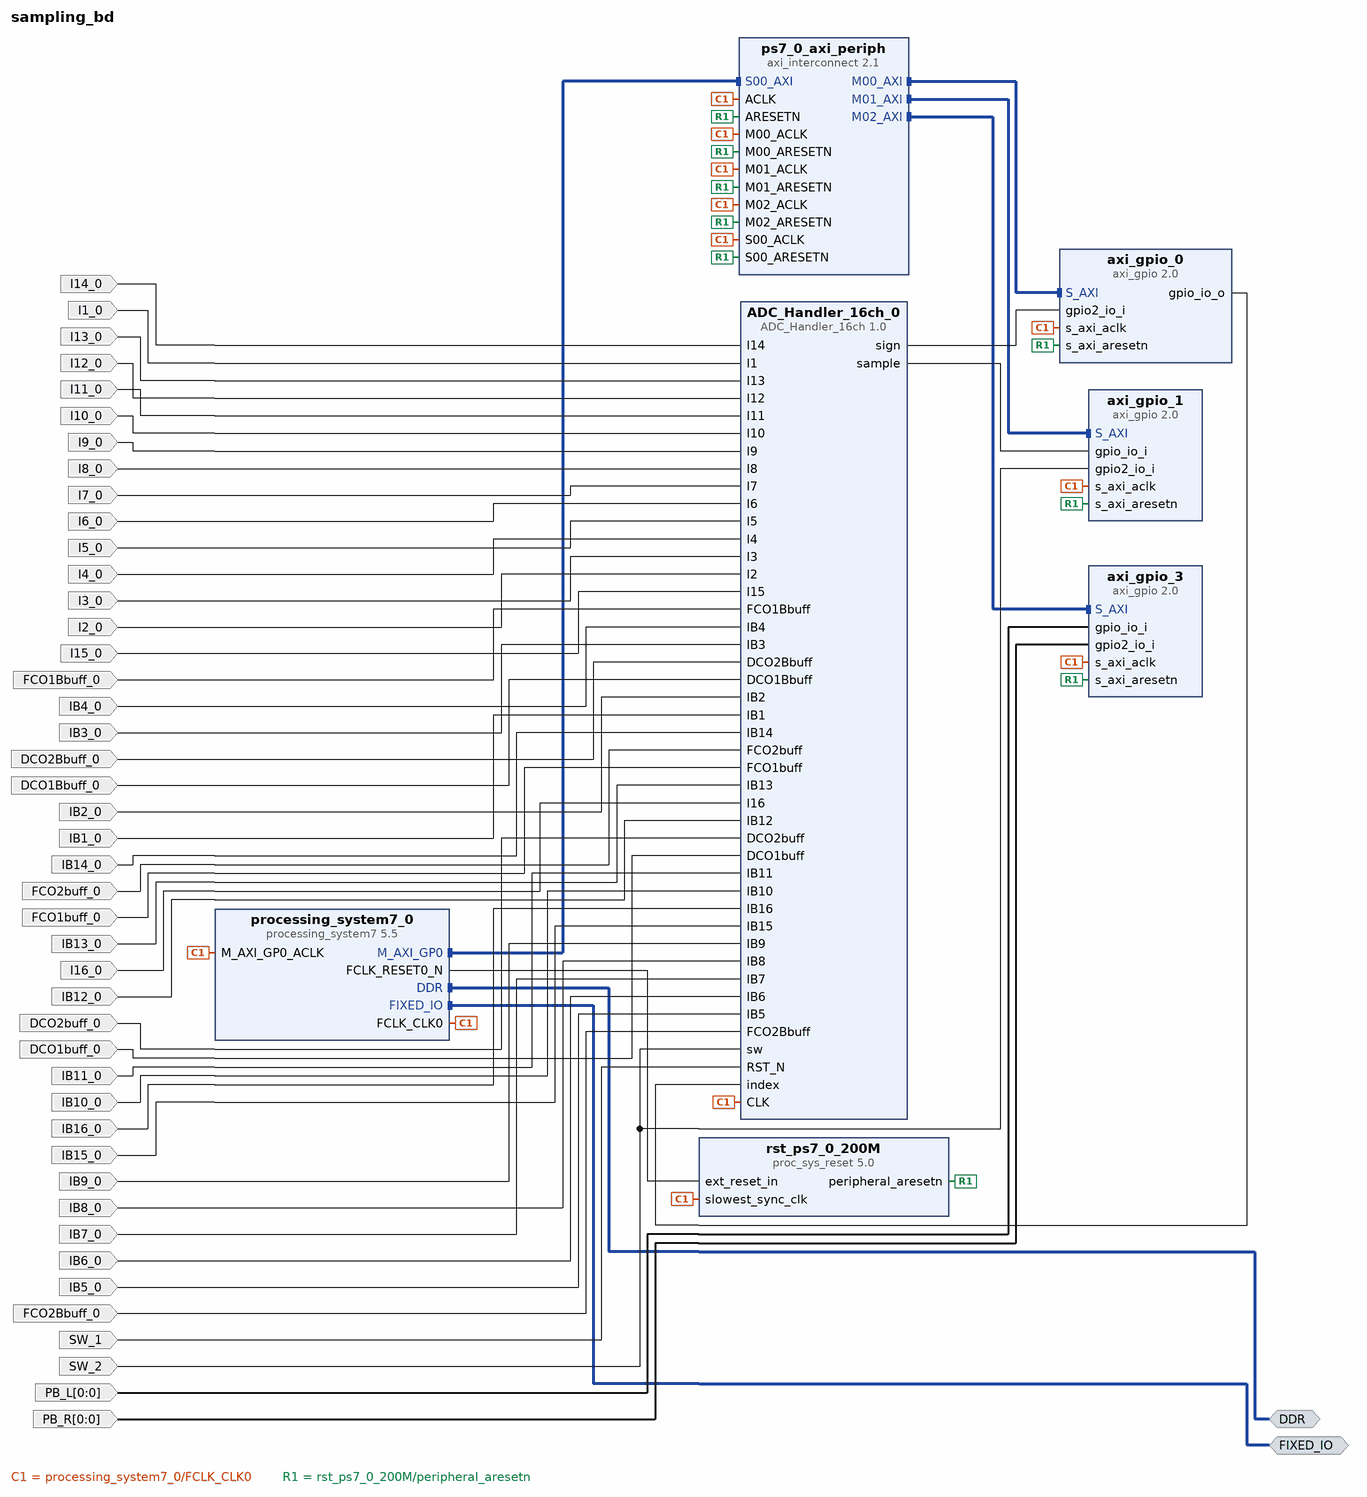
[diagram p0: block diagram of the top level]
# Vivado block design sampling_bd, xc7z020clg484-1, Vivado 2018.3
create_bd_design sampling_bd

create_bd_intf_port -mode Master -vlnv xilinx.com:interface:ddrx_rtl:1.0 DDR
create_bd_intf_port -mode Master -vlnv xilinx.com:display_processing_system7:fixedio_rtl:1.0 FIXED_IO
create_bd_port -dir I I14_0
create_bd_port -dir I I1_0
create_bd_port -dir I I13_0
create_bd_port -dir I I12_0
create_bd_port -dir I I11_0
create_bd_port -dir I I10_0
create_bd_port -dir I I9_0
create_bd_port -dir I I8_0
create_bd_port -dir I I7_0
create_bd_port -dir I I6_0
create_bd_port -dir I I5_0
create_bd_port -dir I I4_0
create_bd_port -dir I I3_0
create_bd_port -dir I I2_0
create_bd_port -dir I I15_0
create_bd_port -dir I FCO1Bbuff_0
create_bd_port -dir I IB4_0
create_bd_port -dir I IB3_0
create_bd_port -dir I DCO2Bbuff_0
create_bd_port -dir I DCO1Bbuff_0
create_bd_port -dir I IB2_0
create_bd_port -dir I IB1_0
create_bd_port -dir I IB14_0
create_bd_port -dir I FCO2buff_0
create_bd_port -dir I FCO1buff_0
create_bd_port -dir I IB13_0
create_bd_port -dir I I16_0
create_bd_port -dir I IB12_0
create_bd_port -dir I DCO2buff_0
create_bd_port -dir I DCO1buff_0
create_bd_port -dir I IB11_0
create_bd_port -dir I IB10_0
create_bd_port -dir I IB16_0
create_bd_port -dir I IB15_0
create_bd_port -dir I IB9_0
create_bd_port -dir I IB8_0
create_bd_port -dir I IB7_0
create_bd_port -dir I IB6_0
create_bd_port -dir I IB5_0
create_bd_port -dir I FCO2Bbuff_0
create_bd_port -dir I -type rst SW_1
create_bd_port -dir I SW_2
create_bd_port -dir I -from 0 -to 0 PB_R
create_bd_port -dir I -from 0 -to 0 PB_L

create_bd_cell -type ip -vlnv xilinx.com:ip:processing_system7:5.5 processing_system7_0
set_property -dict [list \
  CONFIG.PCW_APU_PERIPHERAL_FREQMHZ 666.666666 \
  CONFIG.PCW_CAN0_CAN0_IO {MIO 46 .. 47} \
  CONFIG.PCW_CAN0_PERIPHERAL_ENABLE 1 \
  CONFIG.PCW_CAN_PERIPHERAL_FREQMHZ 23.8095 \
  CONFIG.PCW_ENET0_ENET0_IO {MIO 16 .. 27} \
  CONFIG.PCW_ENET0_GRP_MDIO_ENABLE 1 \
  CONFIG.PCW_ENET0_GRP_MDIO_IO {MIO 52 .. 53} \
  CONFIG.PCW_ENET0_PERIPHERAL_ENABLE 1 \
  CONFIG.PCW_ENET0_PERIPHERAL_FREQMHZ {100 Mbps} \
  CONFIG.PCW_ENET0_RESET_ENABLE 1 \
  CONFIG.PCW_ENET0_RESET_IO {MIO 11} \
  CONFIG.PCW_ENET_RESET_ENABLE 1 \
  CONFIG.PCW_ENET_RESET_SELECT {Share reset pin} \
  CONFIG.PCW_FPGA0_PERIPHERAL_FREQMHZ 200 \
  CONFIG.PCW_GPIO_MIO_GPIO_ENABLE 1 \
  CONFIG.PCW_GPIO_MIO_GPIO_IO MIO \
  CONFIG.PCW_I2C0_GRP_INT_ENABLE 0 \
  CONFIG.PCW_I2C0_I2C0_IO {MIO 50 .. 51} \
  CONFIG.PCW_I2C0_PERIPHERAL_ENABLE 1 \
  CONFIG.PCW_I2C0_RESET_ENABLE 1 \
  CONFIG.PCW_I2C0_RESET_IO {MIO 13} \
  CONFIG.PCW_I2C_PERIPHERAL_FREQMHZ 111.111115 \
  CONFIG.PCW_I2C_RESET_ENABLE 1 \
  CONFIG.PCW_I2C_RESET_SELECT {Share reset pin} \
  CONFIG.PCW_PRESET_BANK0_VOLTAGE {LVCMOS 1.8V} \
  CONFIG.PCW_PRESET_BANK1_VOLTAGE {LVCMOS 1.8V} \
  CONFIG.PCW_QSPI_GRP_FBCLK_ENABLE 1 \
  CONFIG.PCW_QSPI_GRP_FBCLK_IO {MIO 8} \
  CONFIG.PCW_QSPI_GRP_SINGLE_SS_ENABLE 1 \
  CONFIG.PCW_QSPI_GRP_SINGLE_SS_IO {MIO 1 .. 6} \
  CONFIG.PCW_QSPI_PERIPHERAL_ENABLE 1 \
  CONFIG.PCW_QSPI_QSPI_IO {MIO 1 .. 6} \
  CONFIG.PCW_SD0_GRP_CD_ENABLE 1 \
  CONFIG.PCW_SD0_GRP_CD_IO {MIO 0} \
  CONFIG.PCW_SD0_GRP_WP_ENABLE 1 \
  CONFIG.PCW_SD0_GRP_WP_IO {MIO 15} \
  CONFIG.PCW_SD0_PERIPHERAL_ENABLE 1 \
  CONFIG.PCW_SD0_SD0_IO {MIO 40 .. 45} \
  CONFIG.PCW_SDIO_PERIPHERAL_FREQMHZ 50 \
  CONFIG.PCW_SINGLE_QSPI_DATA_MODE x4 \
  CONFIG.PCW_TTC0_PERIPHERAL_ENABLE 1 \
  CONFIG.PCW_TTC0_TTC0_IO EMIO \
  CONFIG.PCW_UART1_PERIPHERAL_ENABLE 1 \
  CONFIG.PCW_UART1_UART1_IO {MIO 48 .. 49} \
  CONFIG.PCW_UART_PERIPHERAL_FREQMHZ 50 \
  CONFIG.PCW_UIPARAM_DDR_FREQ_MHZ 533.333333 \
  CONFIG.PCW_UIPARAM_DDR_PARTNO {MT41J256M8 HX-15E} \
  CONFIG.PCW_USB0_PERIPHERAL_ENABLE 1 \
  CONFIG.PCW_USB0_RESET_ENABLE 1 \
  CONFIG.PCW_USB0_RESET_IO {MIO 7} \
  CONFIG.PCW_USB0_USB0_IO {MIO 28 .. 39} \
  CONFIG.PCW_USB_RESET_ENABLE 1 \
  CONFIG.PCW_USB_RESET_SELECT {Share reset pin} \
  CONFIG.preset ZC702 \
] [get_bd_cells processing_system7_0]
# 222 more settings of processing_system7_0 are not shown: defaults, MIO pin electricals, DDR timing, and values the tool derives
create_bd_cell -type ip -vlnv xilinx.com:user:ADC_Handler_16ch:1.0 ADC_Handler_16ch_0
create_bd_cell -type ip -vlnv xilinx.com:ip:axi_gpio:2.0 axi_gpio_0
set_property -dict [list \
  CONFIG.C_ALL_INPUTS 0 \
  CONFIG.C_ALL_INPUTS_2 1 \
  CONFIG.C_ALL_OUTPUTS 1 \
  CONFIG.C_GPIO_WIDTH 32 \
  CONFIG.C_IS_DUAL 1 \
  CONFIG.GPIO_BOARD_INTERFACE Custom \
  CONFIG.USE_BOARD_FLOW true \
] [get_bd_cells axi_gpio_0]
create_bd_cell -type ip -vlnv xilinx.com:ip:axi_gpio:2.0 axi_gpio_1
set_property -dict [list \
  CONFIG.C_ALL_INPUTS_2 1 \
  CONFIG.C_GPIO2_WIDTH 1 \
  CONFIG.C_GPIO_WIDTH 32 \
  CONFIG.C_IS_DUAL 1 \
  CONFIG.GPIO_BOARD_INTERFACE Custom \
  CONFIG.USE_BOARD_FLOW true \
] [get_bd_cells axi_gpio_1]
create_bd_cell -type ip -vlnv xilinx.com:ip:axi_gpio:2.0 axi_gpio_3
set_property -dict [list \
  CONFIG.C_ALL_INPUTS_2 1 \
  CONFIG.C_GPIO2_WIDTH 1 \
  CONFIG.C_GPIO_WIDTH 1 \
  CONFIG.C_IS_DUAL 1 \
  CONFIG.GPIO_BOARD_INTERFACE Custom \
  CONFIG.USE_BOARD_FLOW true \
] [get_bd_cells axi_gpio_3]
create_bd_cell -type ip -vlnv xilinx.com:ip:axi_interconnect:2.1 ps7_0_axi_periph
set_property -dict {CONFIG.NUM_MI 3} [get_bd_cells ps7_0_axi_periph]
create_bd_cell -type ip -vlnv xilinx.com:ip:proc_sys_reset:5.0 rst_ps7_0_200M

# ---- connections ----

connect_bd_intf_net [get_bd_intf_pins ps7_0_axi_periph/M02_AXI] [get_bd_intf_pins axi_gpio_3/S_AXI]
connect_bd_intf_net [get_bd_intf_pins ps7_0_axi_periph/M00_AXI] [get_bd_intf_pins axi_gpio_0/S_AXI]
connect_bd_intf_net [get_bd_intf_pins ps7_0_axi_periph/M01_AXI] [get_bd_intf_pins axi_gpio_1/S_AXI]
connect_bd_intf_net [get_bd_intf_pins processing_system7_0/M_AXI_GP0] [get_bd_intf_pins ps7_0_axi_periph/S00_AXI]
connect_bd_intf_net [get_bd_intf_ports DDR] [get_bd_intf_pins processing_system7_0/DDR]
connect_bd_intf_net [get_bd_intf_ports FIXED_IO] [get_bd_intf_pins processing_system7_0/FIXED_IO]
connect_bd_net [get_bd_pins processing_system7_0/FCLK_CLK0] \
  [get_bd_pins ADC_Handler_16ch_0/CLK] [get_bd_pins processing_system7_0/M_AXI_GP0_ACLK] \
  [get_bd_pins ps7_0_axi_periph/S00_ACLK] [get_bd_pins rst_ps7_0_200M/slowest_sync_clk] [get_bd_pins axi_gpio_0/s_axi_aclk] \
  [get_bd_pins ps7_0_axi_periph/M00_ACLK] [get_bd_pins ps7_0_axi_periph/ACLK] [get_bd_pins axi_gpio_1/s_axi_aclk] \
  [get_bd_pins ps7_0_axi_periph/M01_ACLK] [get_bd_pins axi_gpio_3/s_axi_aclk] [get_bd_pins ps7_0_axi_periph/M02_ACLK]
connect_bd_net -net I14_0_1 [get_bd_ports I14_0] [get_bd_pins ADC_Handler_16ch_0/I14]
connect_bd_net -net I1_0_1 [get_bd_ports I1_0] [get_bd_pins ADC_Handler_16ch_0/I1]
connect_bd_net -net I13_0_1 [get_bd_ports I13_0] [get_bd_pins ADC_Handler_16ch_0/I13]
connect_bd_net -net I12_0_1 [get_bd_ports I12_0] [get_bd_pins ADC_Handler_16ch_0/I12]
connect_bd_net -net I11_0_1 [get_bd_ports I11_0] [get_bd_pins ADC_Handler_16ch_0/I11]
connect_bd_net -net I10_0_1 [get_bd_ports I10_0] [get_bd_pins ADC_Handler_16ch_0/I10]
connect_bd_net -net I9_0_1 [get_bd_ports I9_0] [get_bd_pins ADC_Handler_16ch_0/I9]
connect_bd_net -net I8_0_1 [get_bd_ports I8_0] [get_bd_pins ADC_Handler_16ch_0/I8]
connect_bd_net -net I7_0_1 [get_bd_ports I7_0] [get_bd_pins ADC_Handler_16ch_0/I7]
connect_bd_net -net I6_0_1 [get_bd_ports I6_0] [get_bd_pins ADC_Handler_16ch_0/I6]
connect_bd_net -net I5_0_1 [get_bd_ports I5_0] [get_bd_pins ADC_Handler_16ch_0/I5]
connect_bd_net -net I4_0_1 [get_bd_ports I4_0] [get_bd_pins ADC_Handler_16ch_0/I4]
connect_bd_net -net I3_0_1 [get_bd_ports I3_0] [get_bd_pins ADC_Handler_16ch_0/I3]
connect_bd_net -net I2_0_1 [get_bd_ports I2_0] [get_bd_pins ADC_Handler_16ch_0/I2]
connect_bd_net -net I15_0_1 [get_bd_ports I15_0] [get_bd_pins ADC_Handler_16ch_0/I15]
connect_bd_net -net FCO1Bbuff_0_1 [get_bd_ports FCO1Bbuff_0] [get_bd_pins ADC_Handler_16ch_0/FCO1Bbuff]
connect_bd_net -net IB4_0_1 [get_bd_ports IB4_0] [get_bd_pins ADC_Handler_16ch_0/IB4]
connect_bd_net -net IB3_0_1 [get_bd_ports IB3_0] [get_bd_pins ADC_Handler_16ch_0/IB3]
connect_bd_net -net DCO2Bbuff_0_1 [get_bd_ports DCO2Bbuff_0] [get_bd_pins ADC_Handler_16ch_0/DCO2Bbuff]
connect_bd_net -net DCO1Bbuff_0_1 [get_bd_ports DCO1Bbuff_0] [get_bd_pins ADC_Handler_16ch_0/DCO1Bbuff]
connect_bd_net -net IB2_0_1 [get_bd_ports IB2_0] [get_bd_pins ADC_Handler_16ch_0/IB2]
connect_bd_net -net IB1_0_1 [get_bd_ports IB1_0] [get_bd_pins ADC_Handler_16ch_0/IB1]
connect_bd_net -net IB14_0_1 [get_bd_ports IB14_0] [get_bd_pins ADC_Handler_16ch_0/IB14]
connect_bd_net -net FCO2buff_0_1 [get_bd_ports FCO2buff_0] [get_bd_pins ADC_Handler_16ch_0/FCO2buff]
connect_bd_net -net FCO1buff_0_1 [get_bd_ports FCO1buff_0] [get_bd_pins ADC_Handler_16ch_0/FCO1buff]
connect_bd_net -net IB13_0_1 [get_bd_ports IB13_0] [get_bd_pins ADC_Handler_16ch_0/IB13]
connect_bd_net -net I16_0_1 [get_bd_ports I16_0] [get_bd_pins ADC_Handler_16ch_0/I16]
connect_bd_net -net IB12_0_1 [get_bd_ports IB12_0] [get_bd_pins ADC_Handler_16ch_0/IB12]
connect_bd_net -net DCO2buff_0_1 [get_bd_ports DCO2buff_0] [get_bd_pins ADC_Handler_16ch_0/DCO2buff]
connect_bd_net -net DCO1buff_0_1 [get_bd_ports DCO1buff_0] [get_bd_pins ADC_Handler_16ch_0/DCO1buff]
connect_bd_net -net IB11_0_1 [get_bd_ports IB11_0] [get_bd_pins ADC_Handler_16ch_0/IB11]
connect_bd_net -net IB10_0_1 [get_bd_ports IB10_0] [get_bd_pins ADC_Handler_16ch_0/IB10]
connect_bd_net -net IB16_0_1 [get_bd_ports IB16_0] [get_bd_pins ADC_Handler_16ch_0/IB16]
connect_bd_net -net IB15_0_1 [get_bd_ports IB15_0] [get_bd_pins ADC_Handler_16ch_0/IB15]
connect_bd_net -net IB9_0_1 [get_bd_ports IB9_0] [get_bd_pins ADC_Handler_16ch_0/IB9]
connect_bd_net -net IB8_0_1 [get_bd_ports IB8_0] [get_bd_pins ADC_Handler_16ch_0/IB8]
connect_bd_net -net IB7_0_1 [get_bd_ports IB7_0] [get_bd_pins ADC_Handler_16ch_0/IB7]
connect_bd_net -net IB6_0_1 [get_bd_ports IB6_0] [get_bd_pins ADC_Handler_16ch_0/IB6]
connect_bd_net -net IB5_0_1 [get_bd_ports IB5_0] [get_bd_pins ADC_Handler_16ch_0/IB5]
connect_bd_net -net FCO2Bbuff_0_1 [get_bd_ports FCO2Bbuff_0] [get_bd_pins ADC_Handler_16ch_0/FCO2Bbuff]
connect_bd_net [get_bd_pins processing_system7_0/FCLK_RESET0_N] [get_bd_pins rst_ps7_0_200M/ext_reset_in]
connect_bd_net [get_bd_pins rst_ps7_0_200M/peripheral_aresetn] \
  [get_bd_pins ps7_0_axi_periph/S00_ARESETN] [get_bd_pins axi_gpio_0/s_axi_aresetn] \
  [get_bd_pins ps7_0_axi_periph/M00_ARESETN] [get_bd_pins ps7_0_axi_periph/ARESETN] [get_bd_pins axi_gpio_1/s_axi_aresetn] \
  [get_bd_pins ps7_0_axi_periph/M01_ARESETN] [get_bd_pins axi_gpio_3/s_axi_aresetn] \
  [get_bd_pins ps7_0_axi_periph/M02_ARESETN]
connect_bd_net -net SW_1_1 [get_bd_ports SW_1] [get_bd_pins ADC_Handler_16ch_0/RST_N]
connect_bd_net [get_bd_pins ADC_Handler_16ch_0/sign] [get_bd_pins axi_gpio_0/gpio2_io_i]
connect_bd_net [get_bd_pins axi_gpio_0/gpio_io_o] [get_bd_pins ADC_Handler_16ch_0/index]
connect_bd_net [get_bd_pins ADC_Handler_16ch_0/sample] [get_bd_pins axi_gpio_1/gpio_io_i]
connect_bd_net [get_bd_ports PB_L] [get_bd_pins axi_gpio_3/gpio_io_i]
connect_bd_net [get_bd_ports PB_R] [get_bd_pins axi_gpio_3/gpio2_io_i]
connect_bd_net [get_bd_ports SW_2] [get_bd_pins axi_gpio_1/gpio2_io_i] [get_bd_pins ADC_Handler_16ch_0/sw]

# ---- address map ----
assign_bd_address -offset 0x41200000 -range 64K -target_address_space [get_bd_addr_spaces processing_system7_0/Data] [get_bd_addr_segs axi_gpio_0/S_AXI/Reg]
assign_bd_address -offset 0x41210000 -range 64K -target_address_space [get_bd_addr_spaces processing_system7_0/Data] [get_bd_addr_segs axi_gpio_1/S_AXI/Reg]
assign_bd_address -offset 0x41220000 -range 64K -target_address_space [get_bd_addr_spaces processing_system7_0/Data] [get_bd_addr_segs axi_gpio_3/S_AXI/Reg]

validate_bd_design
save_bd_design
